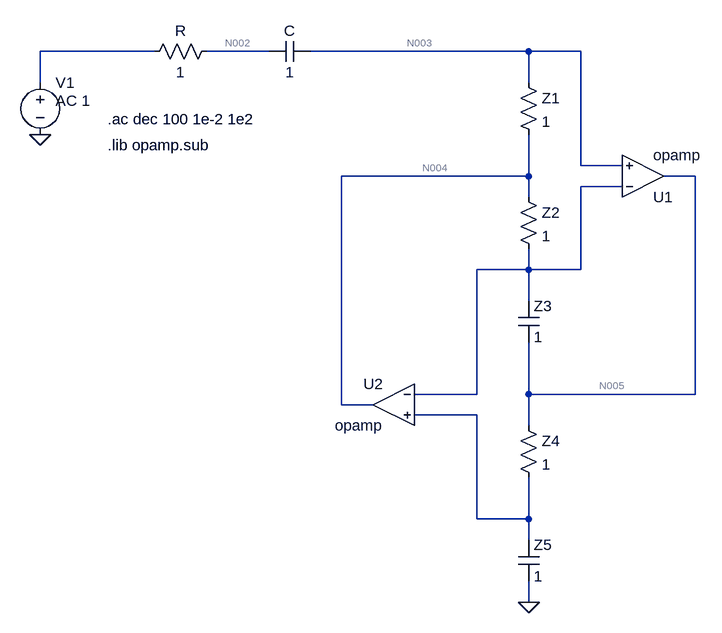
[diagram p0: schematic Draft2.asc]
Draft2.asc, the LTspice schematic file:
Version 4
SHEET 1 880 680
WIRE -480 -976 -656 -976
WIRE -304 -976 -400 -976
WIRE 96 -976 -240 -976
WIRE 176 -976 96 -976
WIRE -656 -928 -656 -976
WIRE 96 -928 96 -976
WIRE 176 -800 176 -976
WIRE 240 -800 176 -800
WIRE 96 -784 96 -848
WIRE 96 -784 -192 -784
WIRE 352 -784 304 -784
WIRE 240 -768 176 -768
WIRE 96 -752 96 -784
WIRE 96 -640 96 -672
WIRE 96 -640 16 -640
WIRE 176 -640 176 -768
WIRE 176 -640 96 -640
WIRE 96 -592 96 -640
WIRE 16 -448 16 -640
WIRE 16 -448 -80 -448
WIRE 96 -448 96 -528
WIRE 352 -448 352 -784
WIRE 352 -448 96 -448
WIRE -192 -432 -192 -784
WIRE -144 -432 -192 -432
WIRE 16 -416 -80 -416
WIRE 96 -400 96 -448
WIRE 16 -256 16 -416
WIRE 96 -256 96 -320
WIRE 96 -256 16 -256
WIRE 96 -224 96 -256
WIRE 96 -128 96 -160
FLAG -656 -848 0
FLAG 96 -128 0
SYMBOL res -384 -992 R90
WINDOW 0 0 56 VBottom 2
WINDOW 3 32 56 VTop 2
SYMATTR InstName R
SYMATTR Value 1
SYMBOL res 80 -944 R0
SYMATTR InstName Z1
SYMATTR Value 1
SYMBOL res 80 -416 R0
SYMATTR InstName Z4
SYMATTR Value 1
SYMBOL Opamps\\opamp 272 -720 M180
SYMATTR InstName U1
SYMBOL Opamps\\opamp -112 -496 M0
SYMATTR InstName U2
SYMBOL voltage -656 -944 R0
WINDOW 123 24 44 Left 2
WINDOW 39 0 0 Left 2
SYMATTR Value2 AC 1
SYMATTR InstName V1
SYMATTR Value ""
SYMBOL cap -304 -960 R270
WINDOW 0 32 32 VTop 2
WINDOW 3 0 32 VBottom 2
SYMATTR InstName C
SYMATTR Value 1
SYMBOL cap 80 -224 R0
SYMATTR InstName Z5
SYMATTR Value 1
SYMBOL cap 80 -592 R0
SYMATTR InstName Z3
SYMATTR Value 1
SYMBOL res 80 -768 R0
SYMATTR InstName Z2
SYMATTR Value 1
TEXT -552 -872 Left 2 !.ac dec 100 1e-2 1e2
TEXT -552 -832 Left 2 !.lib opamp.sub

The netlist it stands for:
* Draft2.asc
R N002 N001 1
R§Z1 N003 N004 1
R§Z4 N005 N007 1
XU1 N006 N003 N005 opamp Aol=100K GBW=10Meg  ; pins invin noninvin out
XU2 N006 N007 N004 opamp Aol=100K GBW=10Meg  ; pins invin noninvin out
V1 N001 0 AC 1
C N002 N003 1
C§Z5 N007 0 1
C§Z3 N006 N005 1
R§Z2 N004 N006 1
.ac dec 100 1e-2 1e2
.lib opamp.sub
.backanno
.end

* Results of the author's LTspice run, read from the files saved beside the schematic
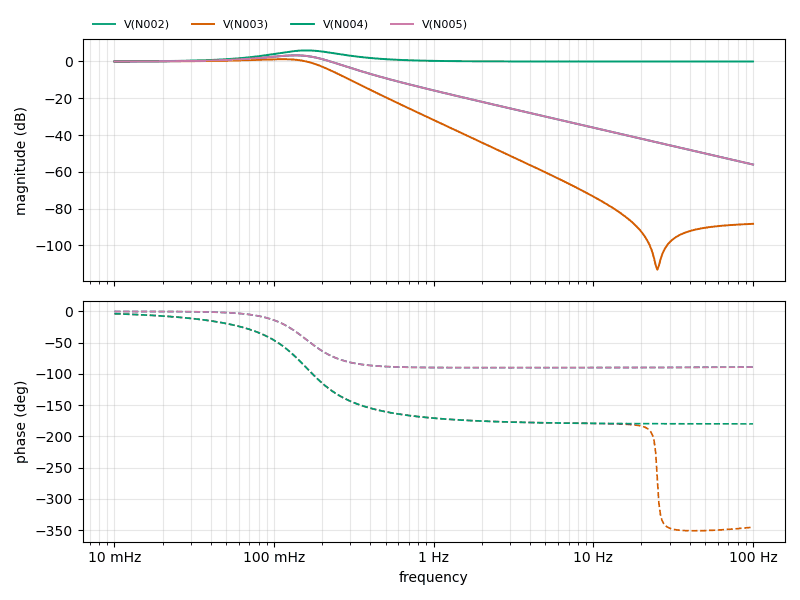
[diagram p1: AC Analysis of Draft2.asc, plotted from the saved traces]
* AC Analysis, 1 run:
*   V(N002): 0.03 dB at 10 mHz, -56.02 dB at 100 Hz, peak 3.33 dB at 134.9 mHz, 3 dB below the peak at 30.95 mHz and 218.8 mHz
*   V(N003): 0.02 dB at 10 mHz, -88.23 dB at 100 Hz, peak 1.25 dB at 112.2 mHz, 3 dB below the peak at 186 mHz
*   V(N004): 0.05 dB at 10 mHz, -0.00 dB at 100 Hz, peak 6.02 dB at 158.5 mHz, 3 dB below the peak at 82.37 mHz and 307.5 mHz
*   V(N005): 0.03 dB at 10 mHz, -56.02 dB at 100 Hz, peak 3.33 dB at 134.9 mHz, 3 dB below the peak at 30.95 mHz and 218.8 mHz